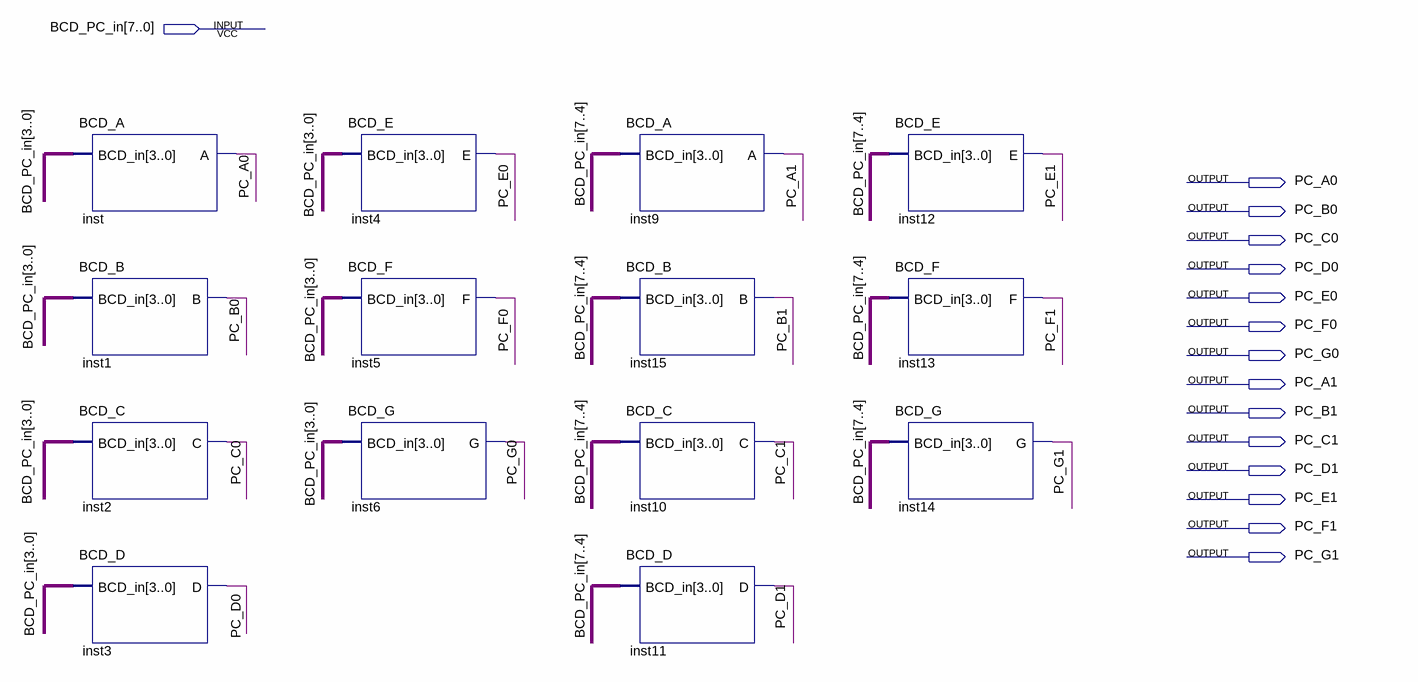
[diagram p0: schematic sheet]
// Quartus schematic BCD_PC.bdf as structural Verilog: 14 symbols, 15 pins
module BCD_PC (
  input  [7:0] BCD_PC_in,
  output PC_A0,
  output PC_B0,
  output PC_C0,
  output PC_D0,
  output PC_E0,
  output PC_F0,
  output PC_G0,
  output PC_A1,
  output PC_B1,
  output PC_C1,
  output PC_D1,
  output PC_E1,
  output PC_F1,
  output PC_G1
);

  BCD_A inst (.BCD_in(BCD_PC_in[3:0]), .A(PC_A0));
  BCD_B inst1 (.BCD_in(BCD_PC_in[3:0]), .B(PC_B0));
  BCD_C inst2 (.BCD_in(BCD_PC_in[3:0]), .C(PC_C0));
  BCD_D inst3 (.BCD_in(BCD_PC_in[3:0]), .D(PC_D0));
  BCD_E inst4 (.BCD_in(BCD_PC_in[3:0]), .E(PC_E0));
  BCD_F inst5 (.BCD_in(BCD_PC_in[3:0]), .F(PC_F0));
  BCD_G inst6 (.BCD_in(BCD_PC_in[3:0]), .G(PC_G0));
  BCD_A inst9 (.BCD_in(BCD_PC_in[7:4]), .A(PC_A1));
  BCD_B inst15 (.BCD_in(BCD_PC_in[7:4]), .B(PC_B1));
  BCD_C inst10 (.BCD_in(BCD_PC_in[7:4]), .C(PC_C1));
  BCD_D inst11 (.BCD_in(BCD_PC_in[7:4]), .D(PC_D1));
  BCD_E inst12 (.BCD_in(BCD_PC_in[7:4]), .E(PC_E1));
  BCD_F inst13 (.BCD_in(BCD_PC_in[7:4]), .F(PC_F1));
  BCD_G inst14 (.BCD_in(BCD_PC_in[7:4]), .G(PC_G1));
endmodule
